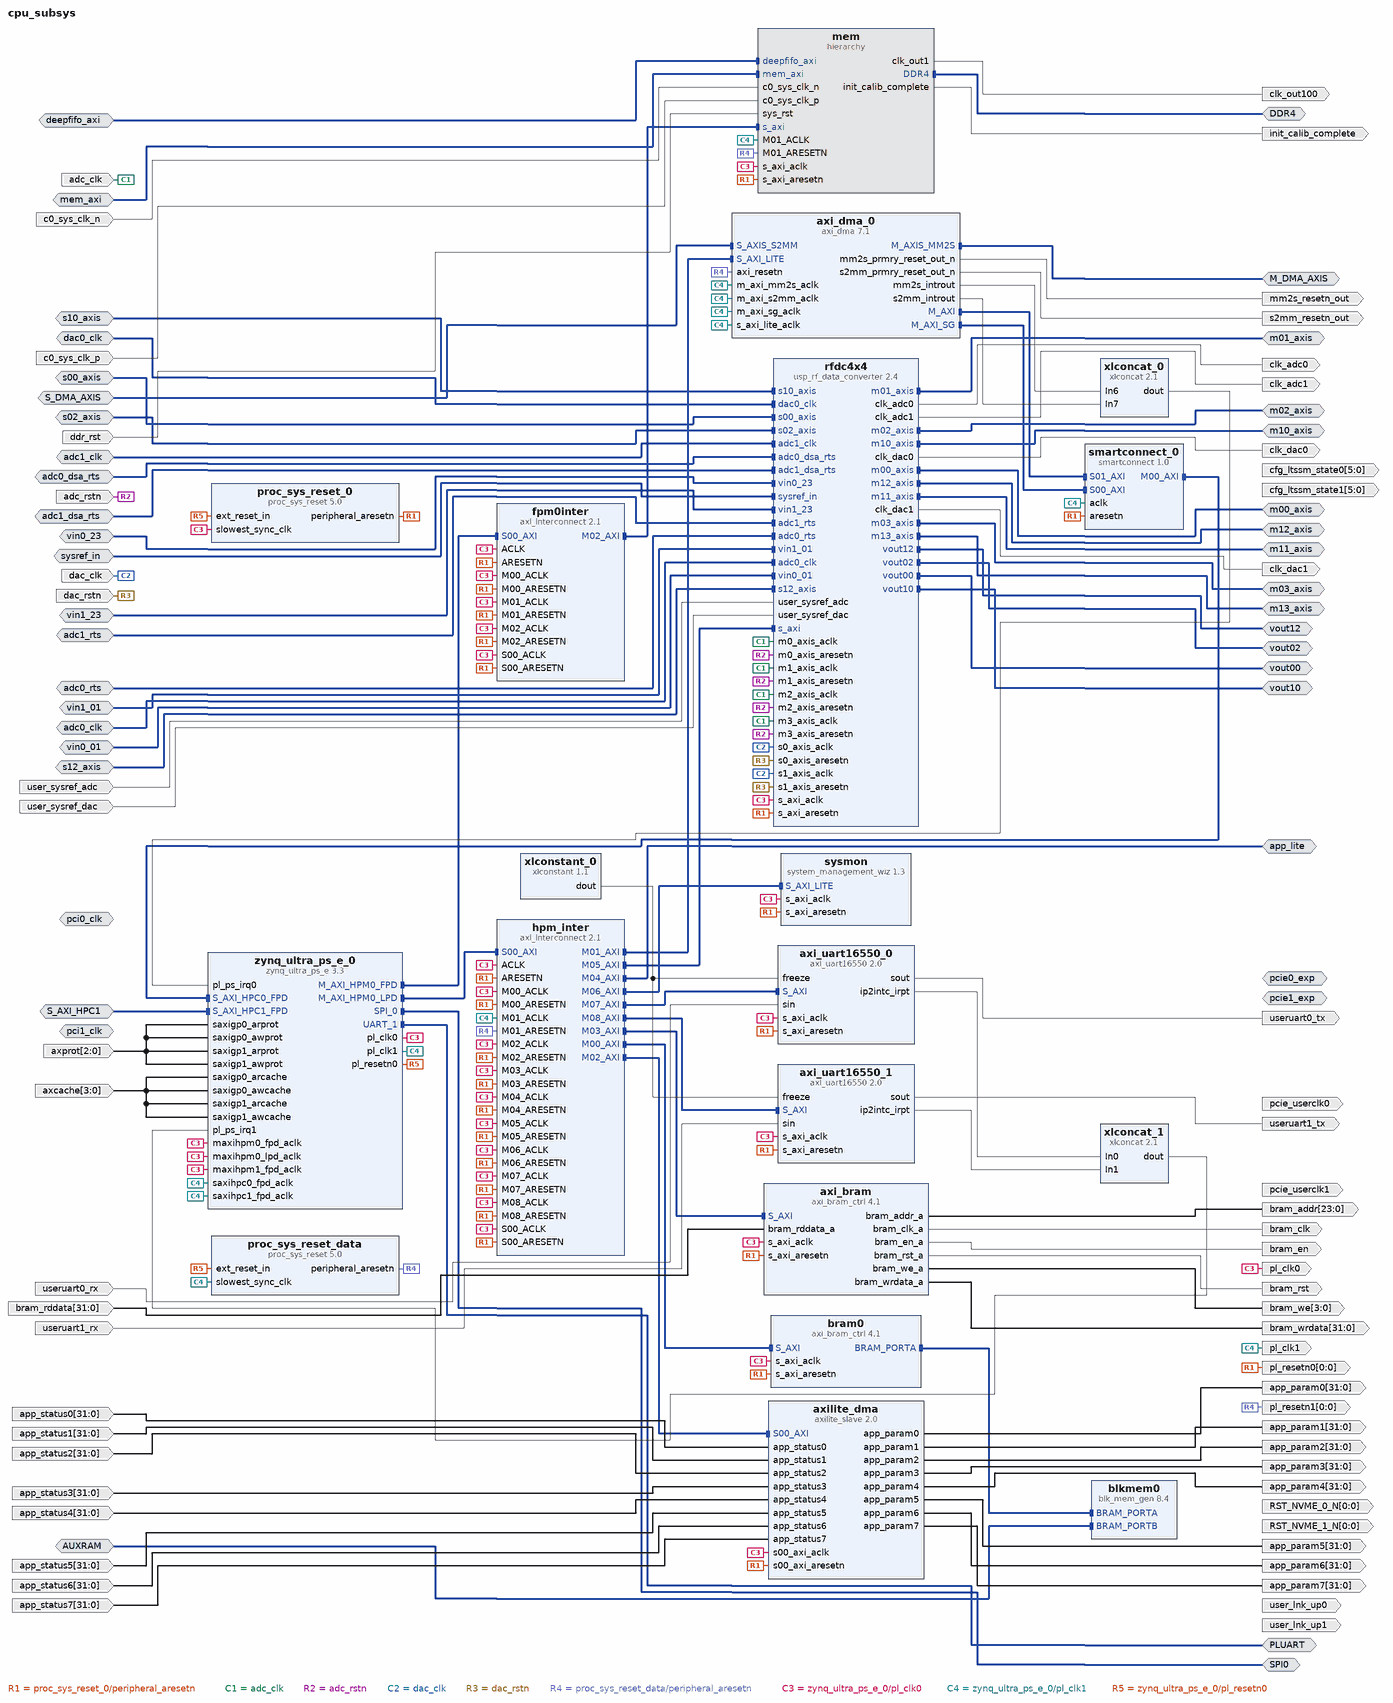
[diagram p0: block diagram of the top level]
# Vivado block design cpu_subsys, xczu47dr-ffve1156-2LVI-i, Vivado 2020.2
create_bd_design cpu_subsys

create_bd_intf_port -mode Slave -vlnv xilinx.com:interface:bram_rtl:1.0 AUXRAM
set_property -dict [list \
  CONFIG.MASTER_TYPE BRAM_CTRL \
  CONFIG.MEM_SIZE 65536 \
  CONFIG.MEM_WIDTH 128 \
  CONFIG.READ_WRITE_MODE READ_WRITE \
] [get_bd_intf_ports AUXRAM]
create_bd_intf_port -mode Master -vlnv xilinx.com:interface:ddr4_rtl:1.0 DDR4
create_bd_intf_port -mode Master -vlnv xilinx.com:interface:axis_rtl:1.0 M_DMA_AXIS
create_bd_intf_port -mode Master -vlnv xilinx.com:interface:uart_rtl:1.0 PLUART
create_bd_intf_port -mode Master -vlnv xilinx.com:interface:spi_rtl:1.0 SPI0
create_bd_intf_port -mode Slave -vlnv xilinx.com:interface:aximm_rtl:1.0 S_AXI_HPC1
set_property -dict [list \
  CONFIG.ADDR_WIDTH 49 \
  CONFIG.ARUSER_WIDTH 1 \
  CONFIG.AWUSER_WIDTH 1 \
  CONFIG.BUSER_WIDTH 0 \
  CONFIG.DATA_WIDTH 128 \
  CONFIG.HAS_BRESP 1 \
  CONFIG.HAS_BURST 1 \
  CONFIG.HAS_CACHE 1 \
  CONFIG.HAS_LOCK 1 \
  CONFIG.HAS_PROT 1 \
  CONFIG.HAS_QOS 1 \
  CONFIG.HAS_REGION 0 \
  CONFIG.HAS_RRESP 1 \
  CONFIG.HAS_WSTRB 1 \
  CONFIG.ID_WIDTH 6 \
  CONFIG.MAX_BURST_LENGTH 256 \
  CONFIG.NUM_READ_OUTSTANDING 16 \
  CONFIG.NUM_READ_THREADS 1 \
  CONFIG.NUM_WRITE_OUTSTANDING 16 \
  CONFIG.NUM_WRITE_THREADS 1 \
  CONFIG.PROTOCOL AXI4 \
  CONFIG.READ_WRITE_MODE READ_WRITE \
  CONFIG.RUSER_BITS_PER_BYTE 0 \
  CONFIG.RUSER_WIDTH 0 \
  CONFIG.SUPPORTS_NARROW_BURST 1 \
  CONFIG.WUSER_BITS_PER_BYTE 0 \
  CONFIG.WUSER_WIDTH 0 \
] [get_bd_intf_ports S_AXI_HPC1]
create_bd_intf_port -mode Slave -vlnv xilinx.com:interface:axis_rtl:1.0 S_DMA_AXIS
set_property -dict [list \
  CONFIG.HAS_TKEEP 1 \
  CONFIG.HAS_TLAST 1 \
  CONFIG.HAS_TREADY 1 \
  CONFIG.HAS_TSTRB 0 \
  CONFIG.LAYERED_METADATA undef \
  CONFIG.TDATA_NUM_BYTES 16 \
  CONFIG.TDEST_WIDTH 0 \
  CONFIG.TID_WIDTH 0 \
  CONFIG.TUSER_WIDTH 0 \
] [get_bd_intf_ports S_DMA_AXIS]
create_bd_intf_port -mode Slave -vlnv xilinx.com:interface:diff_clock_rtl:1.0 adc0_clk
set_property -dict {CONFIG.FREQ_HZ 300000000.0} [get_bd_intf_ports adc0_clk]
create_bd_intf_port -mode Slave -vlnv xilinx.com:interface:rfdc_dsa_rts_pins_rtl:1.0 adc0_dsa_rts
create_bd_intf_port -mode Slave -vlnv xilinx.com:interface:rfdc_rts_pins_rtl:1.0 adc0_rts
create_bd_intf_port -mode Slave -vlnv xilinx.com:interface:diff_clock_rtl:1.0 adc1_clk
create_bd_intf_port -mode Slave -vlnv xilinx.com:interface:rfdc_dsa_rts_pins_rtl:1.0 adc1_dsa_rts
create_bd_intf_port -mode Slave -vlnv xilinx.com:interface:rfdc_rts_pins_rtl:1.0 adc1_rts
create_bd_intf_port -mode Master -vlnv xilinx.com:interface:aximm_rtl:1.0 app_lite
set_property -dict [list \
  CONFIG.ADDR_WIDTH 40 \
  CONFIG.DATA_WIDTH 32 \
  CONFIG.NUM_READ_OUTSTANDING 2 \
  CONFIG.NUM_WRITE_OUTSTANDING 2 \
  CONFIG.PROTOCOL AXI4LITE \
] [get_bd_intf_ports app_lite]
create_bd_intf_port -mode Slave -vlnv xilinx.com:interface:diff_clock_rtl:1.0 dac0_clk
create_bd_intf_port -mode Slave -vlnv xilinx.com:interface:aximm_rtl:1.0 deepfifo_axi
set_property -dict [list \
  CONFIG.ADDR_WIDTH 36 \
  CONFIG.ARUSER_WIDTH 0 \
  CONFIG.AWUSER_WIDTH 0 \
  CONFIG.BUSER_WIDTH 0 \
  CONFIG.DATA_WIDTH 512 \
  CONFIG.HAS_BRESP 1 \
  CONFIG.HAS_BURST 1 \
  CONFIG.HAS_CACHE 1 \
  CONFIG.HAS_LOCK 1 \
  CONFIG.HAS_PROT 1 \
  CONFIG.HAS_QOS 1 \
  CONFIG.HAS_REGION 1 \
  CONFIG.HAS_RRESP 1 \
  CONFIG.HAS_WSTRB 1 \
  CONFIG.ID_WIDTH 0 \
  CONFIG.MAX_BURST_LENGTH 256 \
  CONFIG.NUM_READ_OUTSTANDING 2 \
  CONFIG.NUM_READ_THREADS 1 \
  CONFIG.NUM_WRITE_OUTSTANDING 2 \
  CONFIG.NUM_WRITE_THREADS 1 \
  CONFIG.PROTOCOL AXI4 \
  CONFIG.READ_WRITE_MODE READ_WRITE \
  CONFIG.RUSER_BITS_PER_BYTE 0 \
  CONFIG.RUSER_WIDTH 0 \
  CONFIG.SUPPORTS_NARROW_BURST 1 \
  CONFIG.WUSER_BITS_PER_BYTE 0 \
  CONFIG.WUSER_WIDTH 0 \
] [get_bd_intf_ports deepfifo_axi]
create_bd_intf_port -mode Master -vlnv xilinx.com:interface:axis_rtl:1.0 m00_axis
set_property -dict {CONFIG.FREQ_HZ 150000000} [get_bd_intf_ports m00_axis]
create_bd_intf_port -mode Master -vlnv xilinx.com:interface:axis_rtl:1.0 m01_axis
set_property -dict {CONFIG.FREQ_HZ 150000000} [get_bd_intf_ports m01_axis]
create_bd_intf_port -mode Master -vlnv xilinx.com:interface:axis_rtl:1.0 m02_axis
set_property -dict {CONFIG.FREQ_HZ 150000000} [get_bd_intf_ports m02_axis]
create_bd_intf_port -mode Master -vlnv xilinx.com:interface:axis_rtl:1.0 m03_axis
set_property -dict {CONFIG.FREQ_HZ 150000000} [get_bd_intf_ports m03_axis]
create_bd_intf_port -mode Master -vlnv xilinx.com:interface:axis_rtl:1.0 m10_axis
set_property -dict {CONFIG.FREQ_HZ 150000000} [get_bd_intf_ports m10_axis]
create_bd_intf_port -mode Master -vlnv xilinx.com:interface:axis_rtl:1.0 m11_axis
set_property -dict {CONFIG.FREQ_HZ 150000000} [get_bd_intf_ports m11_axis]
create_bd_intf_port -mode Master -vlnv xilinx.com:interface:axis_rtl:1.0 m12_axis
set_property -dict {CONFIG.FREQ_HZ 150000000} [get_bd_intf_ports m12_axis]
create_bd_intf_port -mode Master -vlnv xilinx.com:interface:axis_rtl:1.0 m13_axis
set_property -dict {CONFIG.FREQ_HZ 150000000} [get_bd_intf_ports m13_axis]
create_bd_intf_port -mode Slave -vlnv xilinx.com:interface:aximm_rtl:1.0 mem_axi
set_property -dict [list \
  CONFIG.ADDR_WIDTH 36 \
  CONFIG.ARUSER_WIDTH 0 \
  CONFIG.AWUSER_WIDTH 0 \
  CONFIG.BUSER_WIDTH 0 \
  CONFIG.DATA_WIDTH 512 \
  CONFIG.HAS_BRESP 1 \
  CONFIG.HAS_BURST 1 \
  CONFIG.HAS_CACHE 1 \
  CONFIG.HAS_LOCK 1 \
  CONFIG.HAS_PROT 1 \
  CONFIG.HAS_QOS 1 \
  CONFIG.HAS_REGION 0 \
  CONFIG.HAS_RRESP 1 \
  CONFIG.HAS_WSTRB 1 \
  CONFIG.ID_WIDTH 0 \
  CONFIG.MAX_BURST_LENGTH 256 \
  CONFIG.NUM_READ_OUTSTANDING 2 \
  CONFIG.NUM_READ_THREADS 1 \
  CONFIG.NUM_WRITE_OUTSTANDING 2 \
  CONFIG.NUM_WRITE_THREADS 1 \
  CONFIG.PROTOCOL AXI4 \
  CONFIG.READ_WRITE_MODE READ_WRITE \
  CONFIG.RUSER_BITS_PER_BYTE 0 \
  CONFIG.RUSER_WIDTH 0 \
  CONFIG.SUPPORTS_NARROW_BURST 1 \
  CONFIG.WUSER_BITS_PER_BYTE 0 \
  CONFIG.WUSER_WIDTH 0 \
] [get_bd_intf_ports mem_axi]
create_bd_intf_port -mode Slave -vlnv xilinx.com:interface:diff_clock_rtl:1.0 pci0_clk
create_bd_intf_port -mode Slave -vlnv xilinx.com:interface:diff_clock_rtl:1.0 pci1_clk
create_bd_intf_port -mode Master -vlnv xilinx.com:interface:pcie_7x_mgt_rtl:1.0 pcie0_exp
create_bd_intf_port -mode Master -vlnv xilinx.com:interface:pcie_7x_mgt_rtl:1.0 pcie1_exp
create_bd_intf_port -mode Slave -vlnv xilinx.com:interface:axis_rtl:1.0 s00_axis
set_property -dict [list \
  CONFIG.FREQ_HZ 150000000 \
  CONFIG.HAS_TKEEP 0 \
  CONFIG.HAS_TLAST 0 \
  CONFIG.HAS_TREADY 1 \
  CONFIG.HAS_TSTRB 0 \
  CONFIG.LAYERED_METADATA undef \
  CONFIG.TDATA_NUM_BYTES 32 \
  CONFIG.TDEST_WIDTH 0 \
  CONFIG.TID_WIDTH 0 \
  CONFIG.TUSER_WIDTH 0 \
] [get_bd_intf_ports s00_axis]
create_bd_intf_port -mode Slave -vlnv xilinx.com:interface:axis_rtl:1.0 s02_axis
set_property -dict [list \
  CONFIG.FREQ_HZ 150000000 \
  CONFIG.HAS_TKEEP 0 \
  CONFIG.HAS_TLAST 0 \
  CONFIG.HAS_TREADY 1 \
  CONFIG.HAS_TSTRB 0 \
  CONFIG.LAYERED_METADATA undef \
  CONFIG.TDATA_NUM_BYTES 32 \
  CONFIG.TDEST_WIDTH 0 \
  CONFIG.TID_WIDTH 0 \
  CONFIG.TUSER_WIDTH 0 \
] [get_bd_intf_ports s02_axis]
create_bd_intf_port -mode Slave -vlnv xilinx.com:interface:axis_rtl:1.0 s10_axis
set_property -dict [list \
  CONFIG.FREQ_HZ 150000000 \
  CONFIG.HAS_TKEEP 0 \
  CONFIG.HAS_TLAST 0 \
  CONFIG.HAS_TREADY 1 \
  CONFIG.HAS_TSTRB 0 \
  CONFIG.LAYERED_METADATA undef \
  CONFIG.TDATA_NUM_BYTES 32 \
  CONFIG.TDEST_WIDTH 0 \
  CONFIG.TID_WIDTH 0 \
  CONFIG.TUSER_WIDTH 0 \
] [get_bd_intf_ports s10_axis]
create_bd_intf_port -mode Slave -vlnv xilinx.com:interface:axis_rtl:1.0 s12_axis
set_property -dict [list \
  CONFIG.FREQ_HZ 150000000 \
  CONFIG.HAS_TKEEP 0 \
  CONFIG.HAS_TLAST 0 \
  CONFIG.HAS_TREADY 1 \
  CONFIG.HAS_TSTRB 0 \
  CONFIG.LAYERED_METADATA undef \
  CONFIG.TDATA_NUM_BYTES 32 \
  CONFIG.TDEST_WIDTH 0 \
  CONFIG.TID_WIDTH 0 \
  CONFIG.TUSER_WIDTH 0 \
] [get_bd_intf_ports s12_axis]
create_bd_intf_port -mode Slave -vlnv xilinx.com:display_usp_rf_data_converter:diff_pins_rtl:1.0 sysref_in
create_bd_intf_port -mode Slave -vlnv xilinx.com:interface:diff_analog_io_rtl:1.0 vin0_01
create_bd_intf_port -mode Slave -vlnv xilinx.com:interface:diff_analog_io_rtl:1.0 vin0_23
create_bd_intf_port -mode Slave -vlnv xilinx.com:interface:diff_analog_io_rtl:1.0 vin1_01
create_bd_intf_port -mode Slave -vlnv xilinx.com:interface:diff_analog_io_rtl:1.0 vin1_23
create_bd_intf_port -mode Master -vlnv xilinx.com:interface:diff_analog_io_rtl:1.0 vout00
create_bd_intf_port -mode Master -vlnv xilinx.com:interface:diff_analog_io_rtl:1.0 vout02
create_bd_intf_port -mode Master -vlnv xilinx.com:interface:diff_analog_io_rtl:1.0 vout10
create_bd_intf_port -mode Master -vlnv xilinx.com:interface:diff_analog_io_rtl:1.0 vout12
create_bd_port -dir O -from 0 -to 0 -type rst RST_NVME_0_N
create_bd_port -dir O -from 0 -to 0 -type rst RST_NVME_1_N
create_bd_port -dir I -type clk adc_clk
set_property -dict [list \
  CONFIG.ASSOCIATED_BUSIF m00_axis:m01_axis:m02_axis:m03_axis:m10_axis:m11_axis:m12_axis:m13_axis \
  CONFIG.ASSOCIATED_RESET adc_rstn \
  CONFIG.FREQ_HZ 150000000 \
] [get_bd_ports adc_clk]
create_bd_port -dir I -type rst adc_rstn
create_bd_port -dir O -from 31 -to 0 app_param0
create_bd_port -dir O -from 31 -to 0 app_param1
create_bd_port -dir O -from 31 -to 0 app_param2
create_bd_port -dir O -from 31 -to 0 app_param3
create_bd_port -dir O -from 31 -to 0 app_param4
create_bd_port -dir O -from 31 -to 0 app_param5
create_bd_port -dir O -from 31 -to 0 app_param6
create_bd_port -dir O -from 31 -to 0 app_param7
create_bd_port -dir I -from 31 -to 0 app_status0
create_bd_port -dir I -from 31 -to 0 app_status1
create_bd_port -dir I -from 31 -to 0 app_status2
create_bd_port -dir I -from 31 -to 0 app_status3
create_bd_port -dir I -from 31 -to 0 app_status4
create_bd_port -dir I -from 31 -to 0 app_status5
create_bd_port -dir I -from 31 -to 0 app_status6
create_bd_port -dir I -from 31 -to 0 app_status7
create_bd_port -dir I -from 3 -to 0 axcache
create_bd_port -dir I -from 2 -to 0 axprot
create_bd_port -dir O -from 23 -to 0 bram_addr
create_bd_port -dir O -type clk bram_clk
set_property -dict {CONFIG.ASSOCIATED_RESET bram_rst} [get_bd_ports bram_clk]
create_bd_port -dir O bram_en
create_bd_port -dir I -from 31 -to 0 bram_rddata
create_bd_port -dir O -type rst bram_rst
create_bd_port -dir O -from 3 -to 0 bram_we
create_bd_port -dir O -from 31 -to 0 bram_wrdata
create_bd_port -dir I -type clk c0_sys_clk_n
set_property -dict {CONFIG.FREQ_HZ 300000000} [get_bd_ports c0_sys_clk_n]
create_bd_port -dir I -type clk c0_sys_clk_p
set_property -dict {CONFIG.ASSOCIATED_RESET ddr_rst CONFIG.FREQ_HZ 300000000} [get_bd_ports c0_sys_clk_p]
create_bd_port -dir O -from 5 -to 0 cfg_ltssm_state0
create_bd_port -dir O -from 5 -to 0 cfg_ltssm_state1
create_bd_port -dir O -type clk clk_adc0
set_property -dict {CONFIG.FREQ_HZ 156250000} [get_bd_ports clk_adc0]
create_bd_port -dir O -type clk clk_adc1
set_property -dict {CONFIG.FREQ_HZ 156250000} [get_bd_ports clk_adc1]
create_bd_port -dir O -type clk clk_dac0
set_property -dict {CONFIG.FREQ_HZ 156250000} [get_bd_ports clk_dac0]
create_bd_port -dir O -type clk clk_dac1
set_property -dict {CONFIG.FREQ_HZ 156250000} [get_bd_ports clk_dac1]
create_bd_port -dir O -type clk clk_out100
create_bd_port -dir I -type clk dac_clk
set_property -dict [list \
  CONFIG.ASSOCIATED_BUSIF s00_axis:s02_axis:s10_axis:s12_axis \
  CONFIG.ASSOCIATED_RESET dac_rstn \
  CONFIG.FREQ_HZ 150000000 \
] [get_bd_ports dac_clk]
create_bd_port -dir I -type rst dac_rstn
create_bd_port -dir I -type rst ddr_rst
set_property -dict {CONFIG.POLARITY ACTIVE_HIGH} [get_bd_ports ddr_rst]
create_bd_port -dir O init_calib_complete
create_bd_port -dir O -type rst mm2s_resetn_out
create_bd_port -dir O -type clk pcie_userclk0
create_bd_port -dir O -type clk pcie_userclk1
create_bd_port -dir O -type clk pl_clk0
set_property -dict {CONFIG.ASSOCIATED_BUSIF app_lite} [get_bd_ports pl_clk0]
create_bd_port -dir O -type clk pl_clk1
set_property -dict [list \
  CONFIG.ASSOCIATED_BUSIF M_DMA_AXIS:S_DMA_AXIS:mem_axi:S_AXI_HPC1:deepfifo_axi \
  CONFIG.ASSOCIATED_RESET mm2s_resetn_out:s2mm_resetn_out:pl_resetn10:pl_resetn1 \
] [get_bd_ports pl_clk1]
create_bd_port -dir O -from 0 -to 0 -type rst pl_resetn0
create_bd_port -dir O -from 0 -to 0 -type rst pl_resetn1
create_bd_port -dir O -type rst s2mm_resetn_out
create_bd_port -dir O user_lnk_up0
create_bd_port -dir O user_lnk_up1
create_bd_port -dir I user_sysref_adc
create_bd_port -dir I user_sysref_dac
create_bd_port -dir I useruart0_rx
create_bd_port -dir O useruart0_tx
create_bd_port -dir I useruart1_rx
create_bd_port -dir O useruart1_tx

create_bd_cell -type ip -vlnv xilinx.com:ip:axi_bram_ctrl:4.1 axi_bram
set_property -dict {CONFIG.PROTOCOL AXI4LITE CONFIG.READ_LATENCY 4 CONFIG.SINGLE_PORT_BRAM 1} [get_bd_cells axi_bram]
create_bd_cell -type ip -vlnv xilinx.com:ip:axi_dma:7.1 axi_dma_0
set_property -dict [list \
  CONFIG.c_addr_width 64 \
  CONFIG.c_include_mm2s 1 \
  CONFIG.c_include_s2mm 1 \
  CONFIG.c_m_axi_mm2s_data_width 128 \
  CONFIG.c_m_axi_s2mm_data_width 128 \
  CONFIG.c_m_axis_mm2s_tdata_width 128 \
  CONFIG.c_mm2s_burst_size 256 \
  CONFIG.c_s2mm_burst_size 256 \
  CONFIG.c_s_axis_s2mm_tdata_width 128 \
  CONFIG.c_sg_include_stscntrl_strm 0 \
  CONFIG.c_sg_length_width 26 \
  CONFIG.c_single_interface 1 \
] [get_bd_cells axi_dma_0]
create_bd_cell -type ip -vlnv xilinx.com:ip:axi_uart16550:2.0 axi_uart16550_0
create_bd_cell -type ip -vlnv xilinx.com:ip:axi_uart16550:2.0 axi_uart16550_1
create_bd_cell -type ip -vlnv xilinx.com:user:axilite_slave:2.0 axilite_dma
create_bd_cell -type ip -vlnv xilinx.com:ip:blk_mem_gen:8.4 blkmem0
set_property -dict [list \
  CONFIG.Memory_Type True_Dual_Port_RAM \
  CONFIG.PRIM_type_to_Implement URAM \
  CONFIG.Port_B_Clock 100 \
  CONFIG.Port_B_Enable_Rate 100 \
  CONFIG.Port_B_Write_Rate 50 \
  CONFIG.Use_RSTB_Pin true \
] [get_bd_cells blkmem0]
create_bd_cell -type ip -vlnv xilinx.com:ip:axi_bram_ctrl:4.1 bram0
set_property -dict {CONFIG.DATA_WIDTH 128 CONFIG.SINGLE_PORT_BRAM 1} [get_bd_cells bram0]
create_bd_cell -type ip -vlnv xilinx.com:ip:axi_interconnect:2.1 fpm0inter
set_property -dict {CONFIG.NUM_MI 3} [get_bd_cells fpm0inter]
create_bd_cell -type ip -vlnv xilinx.com:ip:axi_interconnect:2.1 hpm_inter
set_property -dict {CONFIG.NUM_MI 9 CONFIG.NUM_SI 1} [get_bd_cells hpm_inter]
create_bd_cell -type hier mem
create_bd_cell -type ip -vlnv xilinx.com:ip:proc_sys_reset:5.0 proc_sys_reset_0
create_bd_cell -type ip -vlnv xilinx.com:ip:proc_sys_reset:5.0 proc_sys_reset_data
create_bd_cell -type ip -vlnv xilinx.com:ip:usp_rf_data_converter:2.4 rfdc4x4
set_property -dict [list \
  CONFIG.ADC0_Clock_Dist 0 \
  CONFIG.ADC0_Clock_Source 0 \
  CONFIG.ADC0_Multi_Tile_Sync true \
  CONFIG.ADC0_Outclk_Freq 156.250 \
  CONFIG.ADC0_PLL_Enable true \
  CONFIG.ADC0_Refclk_Freq 400.000 \
  CONFIG.ADC0_Sampling_Rate 5 \
  CONFIG.ADC1_Clock_Dist 1 \
  CONFIG.ADC1_Clock_Source 1 \
  CONFIG.ADC1_Multi_Tile_Sync true \
  CONFIG.ADC1_Outclk_Freq 156.250 \
  CONFIG.ADC1_PLL_Enable true \
  CONFIG.ADC1_Refclk_Freq 400.000 \
  CONFIG.ADC1_Sampling_Rate 5 \
  CONFIG.ADC2_Clock_Source 1 \
  CONFIG.ADC2_Multi_Tile_Sync true \
  CONFIG.ADC2_Outclk_Freq 156.250 \
  CONFIG.ADC2_PLL_Enable true \
  CONFIG.ADC2_Refclk_Freq 400.000 \
  CONFIG.ADC2_Sampling_Rate 5 \
  CONFIG.ADC3_Clock_Source 1 \
  CONFIG.ADC3_Multi_Tile_Sync true \
  CONFIG.ADC3_Outclk_Freq 156.250 \
  CONFIG.ADC3_PLL_Enable true \
  CONFIG.ADC3_Refclk_Freq 400.000 \
  CONFIG.ADC3_Sampling_Rate 5 \
  CONFIG.ADC_CalOpt_Mode00 2 \
  CONFIG.ADC_CalOpt_Mode02 2 \
  CONFIG.ADC_CalOpt_Mode10 2 \
  CONFIG.ADC_CalOpt_Mode12 2 \
  CONFIG.ADC_CalOpt_Mode20 2 \
  CONFIG.ADC_CalOpt_Mode22 2 \
  CONFIG.ADC_CalOpt_Mode30 2 \
  CONFIG.ADC_CalOpt_Mode32 2 \
  CONFIG.ADC_Coarse_Mixer_Freq00 1 \
  CONFIG.ADC_Coarse_Mixer_Freq02 1 \
  CONFIG.ADC_Coarse_Mixer_Freq10 1 \
  CONFIG.ADC_Coarse_Mixer_Freq12 1 \
  CONFIG.ADC_Coarse_Mixer_Freq20 1 \
  CONFIG.ADC_Coarse_Mixer_Freq22 1 \
  CONFIG.ADC_Coarse_Mixer_Freq30 1 \
  CONFIG.ADC_Coarse_Mixer_Freq32 1 \
  CONFIG.ADC_DSA_RTS true \
  CONFIG.ADC_Data_Type00 1 \
  CONFIG.ADC_Data_Type02 1 \
  CONFIG.ADC_Data_Type10 1 \
  CONFIG.ADC_Data_Type12 1 \
  CONFIG.ADC_Data_Type20 1 \
  CONFIG.ADC_Data_Type22 1 \
  CONFIG.ADC_Data_Type30 1 \
  CONFIG.ADC_Data_Type32 1 \
  CONFIG.ADC_Data_Width00 8 \
  CONFIG.ADC_Data_Width02 8 \
  CONFIG.ADC_Data_Width10 8 \
  CONFIG.ADC_Data_Width12 8 \
  CONFIG.ADC_Data_Width20 8 \
  CONFIG.ADC_Data_Width22 8 \
  CONFIG.ADC_Data_Width30 8 \
  CONFIG.ADC_Data_Width32 8 \
  CONFIG.ADC_Decimation_Mode00 4 \
  CONFIG.ADC_Decimation_Mode02 4 \
  CONFIG.ADC_Decimation_Mode10 4 \
  CONFIG.ADC_Decimation_Mode12 4 \
  CONFIG.ADC_Decimation_Mode20 4 \
  CONFIG.ADC_Decimation_Mode22 4 \
  CONFIG.ADC_Decimation_Mode30 4 \
  CONFIG.ADC_Decimation_Mode32 4 \
  CONFIG.ADC_Mixer_Mode00 0 \
  CONFIG.ADC_Mixer_Mode02 0 \
  CONFIG.ADC_Mixer_Mode10 0 \
  CONFIG.ADC_Mixer_Mode12 0 \
  CONFIG.ADC_Mixer_Mode20 0 \
  CONFIG.ADC_Mixer_Mode22 0 \
  CONFIG.ADC_Mixer_Mode30 0 \
  CONFIG.ADC_Mixer_Mode32 0 \
  CONFIG.ADC_Mixer_Type02 1 \
  CONFIG.ADC_Mixer_Type03 1 \
  CONFIG.ADC_Mixer_Type10 1 \
  CONFIG.ADC_Mixer_Type11 1 \
  CONFIG.ADC_Mixer_Type12 1 \
  CONFIG.ADC_Mixer_Type13 1 \
  CONFIG.ADC_Mixer_Type20 1 \
  CONFIG.ADC_Mixer_Type21 1 \
  CONFIG.ADC_Mixer_Type22 1 \
  CONFIG.ADC_Mixer_Type23 1 \
  CONFIG.ADC_Mixer_Type30 1 \
  CONFIG.ADC_Mixer_Type31 1 \
  CONFIG.ADC_Mixer_Type32 1 \
  CONFIG.ADC_Mixer_Type33 1 \
  CONFIG.ADC_Nyquist00 1 \
  CONFIG.ADC_Nyquist02 1 \
  CONFIG.ADC_Nyquist10 1 \
  CONFIG.ADC_Nyquist12 1 \
  CONFIG.ADC_Nyquist20 1 \
  CONFIG.ADC_Nyquist22 1 \
  CONFIG.ADC_Nyquist30 1 \
  CONFIG.ADC_Nyquist32 1 \
  CONFIG.ADC_OBS02 false \
  CONFIG.ADC_OBS12 false \
  CONFIG.ADC_OBS22 false \
  CONFIG.ADC_OBS32 false \
  CONFIG.ADC_RTS true \
  CONFIG.ADC_Slice02_Enable true \
  CONFIG.ADC_Slice10_Enable true \
  CONFIG.ADC_Slice12_Enable true \
  CONFIG.ADC_Slice20_Enable true \
  CONFIG.ADC_Slice22_Enable true \
  CONFIG.ADC_Slice30_Enable true \
  CONFIG.ADC_Slice32_Enable true \
  CONFIG.Axiclk_Freq 100 \
  CONFIG.DAC0_Clock_Dist 1 \
  CONFIG.DAC0_Multi_Tile_Sync true \
  CONFIG.DAC0_Outclk_Freq 156.250 \
  CONFIG.DAC0_PLL_Enable true \
  CONFIG.DAC0_Refclk_Freq 400.000 \
  CONFIG.DAC0_Sampling_Rate 5 \
  CONFIG.DAC1_Clock_Source 4 \
  CONFIG.DAC1_Multi_Tile_Sync true \
  CONFIG.DAC1_Outclk_Freq 156.250 \
  CONFIG.DAC1_PLL_Enable true \
  CONFIG.DAC1_Refclk_Freq 400.000 \
  CONFIG.DAC1_Sampling_Rate 5 \
  CONFIG.DAC_Coarse_Mixer_Freq00 2 \
  CONFIG.DAC_Coarse_Mixer_Freq02 2 \
  CONFIG.DAC_Coarse_Mixer_Freq10 2 \
  CONFIG.DAC_Coarse_Mixer_Freq12 2 \
  CONFIG.DAC_Interpolation_Mode00 4 \
  CONFIG.DAC_Interpolation_Mode02 4 \
  CONFIG.DAC_Interpolation_Mode10 4 \
  CONFIG.DAC_Interpolation_Mode12 4 \
  CONFIG.DAC_Mixer_Mode00 0 \
  CONFIG.DAC_Mixer_Mode02 0 \
  CONFIG.DAC_Mixer_Mode10 0 \
  CONFIG.DAC_Mixer_Mode12 0 \
  CONFIG.DAC_Mixer_Type00 1 \
  CONFIG.DAC_Mixer_Type02 1 \
  CONFIG.DAC_Mixer_Type10 1 \
  CONFIG.DAC_Mixer_Type12 1 \
  CONFIG.DAC_NCO_Freq00 1.8 \
  CONFIG.DAC_NCO_Freq02 1.8 \
  CONFIG.DAC_NCO_Freq10 1.8 \
  CONFIG.DAC_NCO_Freq12 1.8 \
  CONFIG.DAC_Nyquist00 1 \
  CONFIG.DAC_Nyquist02 1 \
  CONFIG.DAC_Nyquist10 1 \
  CONFIG.DAC_Nyquist12 1 \
  CONFIG.DAC_Slice00_Enable true \
  CONFIG.DAC_Slice02_Enable true \
  CONFIG.DAC_Slice10_Enable true \
  CONFIG.DAC_Slice12_Enable true \
  CONFIG.PL_Clock_Freq 156.25 \
  CONFIG.RF_Analyzer 1 \
] [get_bd_cells rfdc4x4]
create_bd_cell -type ip -vlnv xilinx.com:ip:smartconnect:1.0 smartconnect_0
set_property -dict {CONFIG.NUM_CLKS 1} [get_bd_cells smartconnect_0]
create_bd_cell -type ip -vlnv xilinx.com:ip:system_management_wiz:1.3 sysmon
create_bd_cell -type ip -vlnv xilinx.com:ip:xlconcat:2.1 xlconcat_0
set_property -dict {CONFIG.NUM_PORTS 8} [get_bd_cells xlconcat_0]
create_bd_cell -type ip -vlnv xilinx.com:ip:xlconcat:2.1 xlconcat_1
set_property -dict {CONFIG.NUM_PORTS 2} [get_bd_cells xlconcat_1]
create_bd_cell -type ip -vlnv xilinx.com:ip:xlconstant:1.1 xlconstant_0
set_property -dict {CONFIG.CONST_VAL 0} [get_bd_cells xlconstant_0]
create_bd_cell -type ip -vlnv xilinx.com:ip:zynq_ultra_ps_e:3.3 zynq_ultra_ps_e_0
set_property -dict [list \
  CONFIG.CAN0_BOARD_INTERFACE custom \
  CONFIG.CAN1_BOARD_INTERFACE custom \
  CONFIG.CSU_BOARD_INTERFACE custom \
  CONFIG.DP_BOARD_INTERFACE custom \
  CONFIG.GEM0_BOARD_INTERFACE custom \
  CONFIG.GEM1_BOARD_INTERFACE custom \
  CONFIG.GEM2_BOARD_INTERFACE custom \
  CONFIG.GEM3_BOARD_INTERFACE custom \
  CONFIG.GPIO_BOARD_INTERFACE custom \
  CONFIG.IIC0_BOARD_INTERFACE custom \
  CONFIG.IIC1_BOARD_INTERFACE custom \
  CONFIG.NAND_BOARD_INTERFACE custom \
  CONFIG.PCIE_BOARD_INTERFACE custom \
  CONFIG.PJTAG_BOARD_INTERFACE custom \
  CONFIG.PMU_BOARD_INTERFACE custom \
  CONFIG.PSU_BANK_0_IO_STANDARD LVCMOS18 \
  CONFIG.PSU_BANK_1_IO_STANDARD LVCMOS33 \
  CONFIG.PSU_BANK_2_IO_STANDARD LVCMOS18 \
  CONFIG.PSU_BANK_3_IO_STANDARD LVCMOS33 \
  CONFIG.PSU_USB3__DUAL_CLOCK_ENABLE 1 \
  CONFIG.PSU__CAN1__PERIPHERAL__ENABLE 0 \
  CONFIG.PSU__CRF_APB__ACPU_CTRL__FREQMHZ 1200 \
  CONFIG.PSU__CRF_APB__ACPU_CTRL__SRCSEL APLL \
  CONFIG.PSU__CRF_APB__APLL_CTRL__SRCSEL PSS_REF_CLK \
  CONFIG.PSU__CRF_APB__DBG_FPD_CTRL__FREQMHZ 250 \
  CONFIG.PSU__CRF_APB__DBG_FPD_CTRL__SRCSEL IOPLL \
  CONFIG.PSU__CRF_APB__DBG_TRACE_CTRL__FREQMHZ 250 \
  CONFIG.PSU__CRF_APB__DBG_TRACE_CTRL__SRCSEL IOPLL \
  CONFIG.PSU__CRF_APB__DBG_TSTMP_CTRL__FREQMHZ 250 \
  CONFIG.PSU__CRF_APB__DBG_TSTMP_CTRL__SRCSEL IOPLL \
  CONFIG.PSU__CRF_APB__DDR_CTRL__FREQMHZ 1200 \
  CONFIG.PSU__CRF_APB__DDR_CTRL__SRCSEL DPLL \
  CONFIG.PSU__CRF_APB__DPDMA_REF_CTRL__FREQMHZ 600 \
  CONFIG.PSU__CRF_APB__DPDMA_REF_CTRL__SRCSEL DPLL \
  CONFIG.PSU__CRF_APB__DPLL_CTRL__SRCSEL PSS_REF_CLK \
  CONFIG.PSU__CRF_APB__DP_AUDIO_REF_CTRL__SRCSEL RPLL \
  CONFIG.PSU__CRF_APB__DP_STC_REF_CTRL__SRCSEL RPLL \
  CONFIG.PSU__CRF_APB__DP_VIDEO_REF_CTRL__SRCSEL VPLL \
  CONFIG.PSU__CRF_APB__GDMA_REF_CTRL__FREQMHZ 600 \
  CONFIG.PSU__CRF_APB__GDMA_REF_CTRL__SRCSEL DPLL \
  CONFIG.PSU__CRF_APB__GPU_REF_CTRL__FREQMHZ 600 \
  CONFIG.PSU__CRF_APB__GPU_REF_CTRL__SRCSEL DPLL \
  CONFIG.PSU__CRF_APB__TOPSW_LSBUS_CTRL__FREQMHZ 100 \
  CONFIG.PSU__CRF_APB__TOPSW_LSBUS_CTRL__SRCSEL IOPLL \
  CONFIG.PSU__CRF_APB__TOPSW_MAIN_CTRL__FREQMHZ 533 \
  CONFIG.PSU__CRF_APB__TOPSW_MAIN_CTRL__SRCSEL APLL \
  CONFIG.PSU__CRF_APB__VPLL_CTRL__SRCSEL PSS_REF_CLK \
  CONFIG.PSU__CRL_APB__ADMA_REF_CTRL__FREQMHZ 500 \
  CONFIG.PSU__CRL_APB__ADMA_REF_CTRL__SRCSEL IOPLL \
  CONFIG.PSU__CRL_APB__CAN1_REF_CTRL__FREQMHZ 100 \
  CONFIG.PSU__CRL_APB__CAN1_REF_CTRL__SRCSEL IOPLL \
  CONFIG.PSU__CRL_APB__CPU_R5_CTRL__FREQMHZ 500 \
  CONFIG.PSU__CRL_APB__CPU_R5_CTRL__SRCSEL IOPLL \
  CONFIG.PSU__CRL_APB__DBG_LPD_CTRL__FREQMHZ 250 \
  CONFIG.PSU__CRL_APB__DBG_LPD_CTRL__SRCSEL IOPLL \
  CONFIG.PSU__CRL_APB__GEM3_REF_CTRL__FREQMHZ 125 \
  CONFIG.PSU__CRL_APB__GEM3_REF_CTRL__SRCSEL IOPLL \
  CONFIG.PSU__CRL_APB__I2C0_REF_CTRL__FREQMHZ 100 \
  CONFIG.PSU__CRL_APB__I2C0_REF_CTRL__SRCSEL IOPLL \
  CONFIG.PSU__CRL_APB__I2C1_REF_CTRL__FREQMHZ 100 \
  CONFIG.PSU__CRL_APB__I2C1_REF_CTRL__SRCSEL IOPLL \
  CONFIG.PSU__CRL_APB__IOPLL_CTRL__SRCSEL PSS_REF_CLK \
  CONFIG.PSU__CRL_APB__IOU_SWITCH_CTRL__FREQMHZ 250 \
  CONFIG.PSU__CRL_APB__IOU_SWITCH_CTRL__SRCSEL IOPLL \
  CONFIG.PSU__CRL_APB__LPD_LSBUS_CTRL__FREQMHZ 100 \
  CONFIG.PSU__CRL_APB__LPD_LSBUS_CTRL__SRCSEL IOPLL \
  CONFIG.PSU__CRL_APB__LPD_SWITCH_CTRL__FREQMHZ 500 \
  CONFIG.PSU__CRL_APB__LPD_SWITCH_CTRL__SRCSEL IOPLL \
  CONFIG.PSU__CRL_APB__PCAP_CTRL__FREQMHZ 200 \
  CONFIG.PSU__CRL_APB__PCAP_CTRL__SRCSEL IOPLL \
  CONFIG.PSU__CRL_APB__PL0_REF_CTRL__FREQMHZ 100 \
  CONFIG.PSU__CRL_APB__PL0_REF_CTRL__SRCSEL IOPLL \
  CONFIG.PSU__CRL_APB__PL1_REF_CTRL__FREQMHZ 200 \
  CONFIG.PSU__CRL_APB__QSPI_REF_CTRL__FREQMHZ 125 \
  CONFIG.PSU__CRL_APB__QSPI_REF_CTRL__SRCSEL IOPLL \
  CONFIG.PSU__CRL_APB__RPLL_CTRL__SRCSEL PSS_REF_CLK \
  CONFIG.PSU__CRL_APB__SDIO0_REF_CTRL__SRCSEL IOPLL \
  CONFIG.PSU__CRL_APB__SDIO1_REF_CTRL__FREQMHZ 200 \
  CONFIG.PSU__CRL_APB__SDIO1_REF_CTRL__SRCSEL IOPLL \
  CONFIG.PSU__CRL_APB__SPI0_REF_CTRL__SRCSEL IOPLL \
  CONFIG.PSU__CRL_APB__SPI1_REF_CTRL__SRCSEL IOPLL \
  CONFIG.PSU__CRL_APB__TIMESTAMP_REF_CTRL__FREQMHZ 100 \
  CONFIG.PSU__CRL_APB__TIMESTAMP_REF_CTRL__SRCSEL IOPLL \
  CONFIG.PSU__CRL_APB__UART0_REF_CTRL__FREQMHZ 100 \
  CONFIG.PSU__CRL_APB__UART0_REF_CTRL__SRCSEL IOPLL \
  CONFIG.PSU__CRL_APB__UART1_REF_CTRL__FREQMHZ 100 \
  CONFIG.PSU__CRL_APB__UART1_REF_CTRL__SRCSEL IOPLL \
  CONFIG.PSU__CRL_APB__USB0_BUS_REF_CTRL__FREQMHZ 250 \
  CONFIG.PSU__CRL_APB__USB0_BUS_REF_CTRL__SRCSEL IOPLL \
  CONFIG.PSU__CRL_APB__USB3_DUAL_REF_CTRL__FREQMHZ 20 \
  CONFIG.PSU__CRL_APB__USB3_DUAL_REF_CTRL__SRCSEL IOPLL \
  CONFIG.PSU__CRL_APB__USB3__ENABLE 1 \
  CONFIG.PSU__CSUPMU__PERIPHERAL__VALID 0 \
  CONFIG.PSU__DDRC__BUS_WIDTH {64 Bit} \
  CONFIG.PSU__DDRC__COMPONENTS Components \
  CONFIG.PSU__DDRC__DEVICE_CAPACITY {8192 MBits} \
  CONFIG.PSU__DDRC__DRAM_WIDTH {16 Bits} \
  CONFIG.PSU__DDRC__ECC Disabled \
  CONFIG.PSU__DDRC__MEMORY_TYPE {DDR 4} \
  CONFIG.PSU__DDRC__SPEED_BIN DDR4_2400P \
  CONFIG.PSU__DDR_HIGH_ADDRESS_GUI_ENABLE 1 \
  CONFIG.PSU__DDR__INTERFACE__FREQMHZ 600.000 \
  CONFIG.PSU__DEVICE_TYPE RFSOC \
  CONFIG.PSU__DISPLAYPORT__PERIPHERAL__ENABLE 0 \
  CONFIG.PSU__DLL__ISUSED 1 \
  CONFIG.PSU__ENET3__FIFO__ENABLE 0 \
  CONFIG.PSU__ENET3__GRP_MDIO__ENABLE 1 \
  CONFIG.PSU__ENET3__GRP_MDIO__IO {MIO 76 .. 77} \
  CONFIG.PSU__ENET3__PERIPHERAL__ENABLE 1 \
  CONFIG.PSU__ENET3__PERIPHERAL__IO {GT Lane3} \
  CONFIG.PSU__ENET3__PTP__ENABLE 0 \
  CONFIG.PSU__ENET3__TSU__ENABLE 0 \
  CONFIG.PSU__FPGA_PL0_ENABLE 1 \
  CONFIG.PSU__FPGA_PL1_ENABLE 1 \
  CONFIG.PSU__GEM3_COHERENCY 0 \
  CONFIG.PSU__GEM3_ROUTE_THROUGH_FPD 0 \
  CONFIG.PSU__GEM3__REF_CLK_FREQ 125 \
  CONFIG.PSU__GEM3__REF_CLK_SEL {Ref Clk3} \
  CONFIG.PSU__GEM__TSU__ENABLE 0 \
  CONFIG.PSU__GPIO0_MIO__IO {MIO 0 .. 25} \
  CONFIG.PSU__GPIO0_MIO__PERIPHERAL__ENABLE 1 \
  CONFIG.PSU__GPIO1_MIO__IO {MIO 26 .. 51} \
  CONFIG.PSU__GPIO1_MIO__PERIPHERAL__ENABLE 1 \
  CONFIG.PSU__GPIO2_MIO__IO {MIO 52 .. 77} \
  CONFIG.PSU__GPIO2_MIO__PERIPHERAL__ENABLE 1 \
  CONFIG.PSU__GPIO_EMIO__WIDTH {[93:0]} \
  CONFIG.PSU__GPU_PP0__POWER__ON 0 \
  CONFIG.PSU__GPU_PP1__POWER__ON 0 \
  CONFIG.PSU__I2C0__PERIPHERAL__ENABLE 1 \
  CONFIG.PSU__I2C0__PERIPHERAL__IO {MIO 30 .. 31} \
  CONFIG.PSU__I2C1__PERIPHERAL__ENABLE 1 \
  CONFIG.PSU__I2C1__PERIPHERAL__IO {MIO 40 .. 41} \
  CONFIG.PSU__IOU_SLCR__IOU_TTC_APB_CLK__TTC0_SEL APB \
  CONFIG.PSU__IOU_SLCR__IOU_TTC_APB_CLK__TTC1_SEL APB \
  CONFIG.PSU__IOU_SLCR__IOU_TTC_APB_CLK__TTC2_SEL APB \
  CONFIG.PSU__IOU_SLCR__IOU_TTC_APB_CLK__TTC3_SEL APB \
  CONFIG.PSU__LPD_SLCR__CSUPMU__FREQMHZ 100 \
  CONFIG.PSU__MAXIGP0__DATA_WIDTH 128 \
  CONFIG.PSU__MAXIGP2__DATA_WIDTH 128 \
  CONFIG.PSU__NUM_FABRIC_RESETS 2 \
  CONFIG.PSU__OVERRIDE_HPX_QOS 0 \
  CONFIG.PSU__OVERRIDE__BASIC_CLOCK 0 \
  CONFIG.PSU__PCIE__BAR0_VAL 0x0 \
  CONFIG.PSU__PCIE__BAR1_VAL 0x0 \
  CONFIG.PSU__PCIE__BAR2_VAL 0x0 \
  CONFIG.PSU__PCIE__BAR3_VAL 0x0 \
  CONFIG.PSU__PCIE__BAR4_VAL 0x0 \
  CONFIG.PSU__PCIE__BAR5_VAL 0x0 \
  CONFIG.PSU__PCIE__CLASS_CODE_BASE 0x06 \
  CONFIG.PSU__PCIE__CLASS_CODE_INTERFACE 0x0 \
  CONFIG.PSU__PCIE__CLASS_CODE_SUB 0x04 \
  CONFIG.PSU__PCIE__CLASS_CODE_VALUE 0x60400 \
  CONFIG.PSU__PCIE__DEVICE_ID 0xD011 \
  CONFIG.PSU__PCIE__DEVICE_PORT_TYPE {Root Port} \
  CONFIG.PSU__PCIE__EROM_VAL 0x0 \
  CONFIG.PSU__PCIE__LANE0__ENABLE 1 \
  CONFIG.PSU__PCIE__LANE0__IO {GT Lane0} \
  CONFIG.PSU__PCIE__LANE1__ENABLE 1 \
  CONFIG.PSU__PCIE__LANE1__IO {GT Lane1} \
  CONFIG.PSU__PCIE__LINK_SPEED {5.0 Gb/s} \
  CONFIG.PSU__PCIE__MAXIMUM_LINK_WIDTH x2 \
  CONFIG.PSU__PCIE__MAX_PAYLOAD_SIZE {256 bytes} \
  CONFIG.PSU__PCIE__PERIPHERAL__ENABLE 1 \
  CONFIG.PSU__PCIE__PERIPHERAL__ENDPOINT_ENABLE 0 \
  CONFIG.PSU__PCIE__PERIPHERAL__ROOTPORT_ENABLE 1 \
  CONFIG.PSU__PCIE__PERIPHERAL__ROOTPORT_IO {MIO 49} \
  CONFIG.PSU__PCIE__REF_CLK_FREQ 100 \
  CONFIG.PSU__PCIE__REF_CLK_SEL {Ref Clk0} \
  CONFIG.PSU__PCIE__REVISION_ID 0x0 \
  CONFIG.PSU__PCIE__SUBSYSTEM_ID 0x7 \
  CONFIG.PSU__PCIE__SUBSYSTEM_VENDOR_ID 0x10EE \
  CONFIG.PSU__PCIE__VENDOR_ID 0x10EE \
  CONFIG.PSU__PMU__PERIPHERAL__ENABLE 0 \
  CONFIG.PSU__PRESET_APPLIED 0 \
  CONFIG.PSU__PSS_REF_CLK__FREQMHZ 33.333 \
  CONFIG.PSU__QSPI_COHERENCY 0 \
  CONFIG.PSU__QSPI_ROUTE_THROUGH_FPD 0 \
  CONFIG.PSU__QSPI__GRP_FBCLK__ENABLE 0 \
  CONFIG.PSU__QSPI__PERIPHERAL__DATA_MODE x4 \
  CONFIG.PSU__QSPI__PERIPHERAL__ENABLE 1 \
  CONFIG.PSU__QSPI__PERIPHERAL__IO {MIO 0 .. 5} \
  CONFIG.PSU__QSPI__PERIPHERAL__MODE Single \
  CONFIG.PSU__SATA__PERIPHERAL__ENABLE 0 \
  CONFIG.PSU__SD0__DATA_TRANSFER_MODE 8Bit \
  CONFIG.PSU__SD0__GRP_POW__ENABLE 1 \
  CONFIG.PSU__SD0__GRP_POW__IO {MIO 23} \
  CONFIG.PSU__SD0__PERIPHERAL__ENABLE 1 \
  CONFIG.PSU__SD0__PERIPHERAL__IO {MIO 13 .. 22} \
  CONFIG.PSU__SD0__RESET__ENABLE 1 \
  CONFIG.PSU__SD0__SLOT_TYPE eMMC \
  CONFIG.PSU__SD1__PERIPHERAL__ENABLE 0 \
  CONFIG.PSU__SPI0__GRP_SS0__IO EMIO \
  CONFIG.PSU__SPI0__PERIPHERAL__ENABLE 1 \
  CONFIG.PSU__SPI0__PERIPHERAL__IO EMIO \
  CONFIG.PSU__SWDT0__CLOCK__ENABLE 0 \
  CONFIG.PSU__SWDT0__PERIPHERAL__ENABLE 1 \
  CONFIG.PSU__SWDT0__RESET__ENABLE 0 \
  CONFIG.PSU__SWDT1__CLOCK__ENABLE 0 \
  CONFIG.PSU__SWDT1__PERIPHERAL__ENABLE 1 \
  CONFIG.PSU__SWDT1__RESET__ENABLE 0 \
  CONFIG.PSU__TSU__BUFG_PORT_PAIR 0 \
  CONFIG.PSU__TTC0__CLOCK__ENABLE 0 \
  CONFIG.PSU__TTC0__PERIPHERAL__ENABLE 1 \
  CONFIG.PSU__TTC0__WAVEOUT__ENABLE 0 \
  CONFIG.PSU__TTC1__CLOCK__ENABLE 0 \
  CONFIG.PSU__TTC1__PERIPHERAL__ENABLE 1 \
  CONFIG.PSU__TTC1__WAVEOUT__ENABLE 0 \
  CONFIG.PSU__TTC2__CLOCK__ENABLE 0 \
  CONFIG.PSU__TTC2__PERIPHERAL__ENABLE 1 \
  CONFIG.PSU__TTC2__WAVEOUT__ENABLE 0 \
  CONFIG.PSU__TTC3__CLOCK__ENABLE 0 \
  CONFIG.PSU__TTC3__PERIPHERAL__ENABLE 1 \
  CONFIG.PSU__TTC3__WAVEOUT__ENABLE 0 \
  CONFIG.PSU__UART0__BAUD_RATE 115200 \
  CONFIG.PSU__UART0__MODEM__ENABLE 0 \
  CONFIG.PSU__UART0__PERIPHERAL__ENABLE 1 \
  CONFIG.PSU__UART0__PERIPHERAL__IO {MIO 26 .. 27} \
  CONFIG.PSU__UART1__BAUD_RATE 115200 \
  CONFIG.PSU__UART1__MODEM__ENABLE 0 \
  CONFIG.PSU__UART1__PERIPHERAL__ENABLE 1 \
  CONFIG.PSU__UART1__PERIPHERAL__IO EMIO \
  CONFIG.PSU__USB0_COHERENCY 0 \
  CONFIG.PSU__USB0__PERIPHERAL__ENABLE 1 \
  CONFIG.PSU__USB0__PERIPHERAL__IO {MIO 52 .. 63} \
  CONFIG.PSU__USB0__REF_CLK_FREQ 26 \
  CONFIG.PSU__USB0__REF_CLK_SEL {Ref Clk2} \
  CONFIG.PSU__USB2_0__EMIO__ENABLE 0 \
  CONFIG.PSU__USB3_0__EMIO__ENABLE 0 \
  CONFIG.PSU__USB3_0__PERIPHERAL__ENABLE 1 \
  CONFIG.PSU__USB3_0__PERIPHERAL__IO {GT Lane2} \
  CONFIG.PSU__USB__RESET__MODE {Boot Pin} \
  CONFIG.PSU__USB__RESET__POLARITY {Active Low} \
  CONFIG.PSU__USE__IRQ0 1 \
  CONFIG.PSU__USE__IRQ1 1 \
  CONFIG.PSU__USE__M_AXI_GP0 1 \
  CONFIG.PSU__USE__M_AXI_GP1 1 \
  CONFIG.PSU__USE__M_AXI_GP2 1 \
  CONFIG.PSU__USE__S_AXI_GP0 1 \
  CONFIG.PSU__USE__S_AXI_GP1 1 \
  CONFIG.QSPI_BOARD_INTERFACE custom \
  CONFIG.SATA_BOARD_INTERFACE custom \
  CONFIG.SD0_BOARD_INTERFACE custom \
  CONFIG.SD1_BOARD_INTERFACE custom \
  CONFIG.SPI0_BOARD_INTERFACE custom \
  CONFIG.SPI1_BOARD_INTERFACE custom \
  CONFIG.SUBPRESET1 Custom \
  CONFIG.SUBPRESET2 Custom \
  CONFIG.SWDT0_BOARD_INTERFACE custom \
  CONFIG.SWDT1_BOARD_INTERFACE custom \
  CONFIG.TRACE_BOARD_INTERFACE custom \
  CONFIG.TTC0_BOARD_INTERFACE custom \
  CONFIG.TTC1_BOARD_INTERFACE custom \
  CONFIG.TTC2_BOARD_INTERFACE custom \
  CONFIG.TTC3_BOARD_INTERFACE custom \
  CONFIG.UART0_BOARD_INTERFACE custom \
  CONFIG.UART1_BOARD_INTERFACE custom \
  CONFIG.USB0_BOARD_INTERFACE custom \
  CONFIG.USB1_BOARD_INTERFACE custom \
  CONFIG.preset None \
] [get_bd_cells zynq_ultra_ps_e_0]
# 793 more settings of zynq_ultra_ps_e_0 are not shown: defaults, MIO pin electricals, DDR timing, and values the tool derives

# ---- hierarchy /mem ----
current_bd_instance /mem
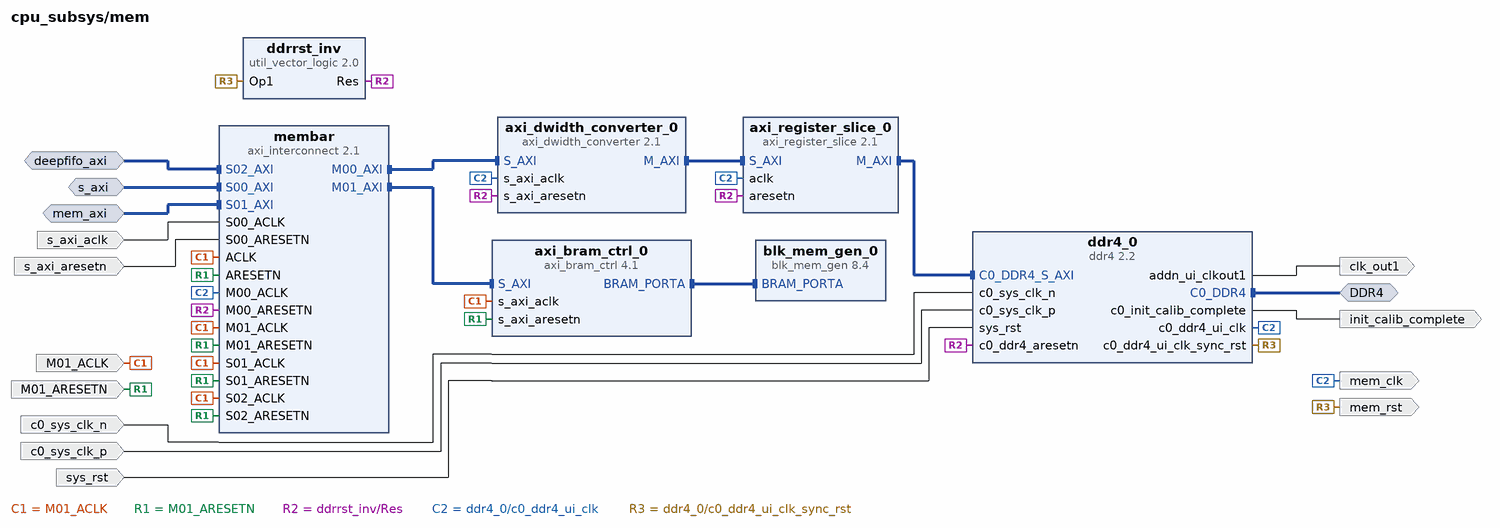
[diagram p1: block diagram inside /mem]
create_bd_intf_pin -mode Master -vlnv xilinx.com:interface:ddr4_rtl:1.0 DDR4
create_bd_intf_pin -mode Slave -vlnv xilinx.com:interface:aximm_rtl:1.0 deepfifo_axi
create_bd_intf_pin -mode Slave -vlnv xilinx.com:interface:aximm_rtl:1.0 mem_axi
create_bd_intf_pin -mode Slave -vlnv xilinx.com:interface:aximm_rtl:1.0 s_axi
create_bd_pin -dir I -type clk M01_ACLK
create_bd_pin -dir I -type rst M01_ARESETN
create_bd_pin -dir I -type clk c0_sys_clk_n
create_bd_pin -dir I -type clk c0_sys_clk_p
create_bd_pin -dir O -type clk clk_out1
create_bd_pin -dir O init_calib_complete
create_bd_pin -dir O -type clk mem_clk
create_bd_pin -dir O -type rst mem_rst
create_bd_pin -dir I -type clk s_axi_aclk
create_bd_pin -dir I -type rst s_axi_aresetn
create_bd_pin -dir I -type rst sys_rst

create_bd_cell -type ip -vlnv xilinx.com:ip:axi_bram_ctrl:4.1 axi_bram_ctrl_0
set_property -dict {CONFIG.DATA_WIDTH 512 CONFIG.SINGLE_PORT_BRAM 1} [get_bd_cells axi_bram_ctrl_0]
create_bd_cell -type ip -vlnv xilinx.com:ip:axi_dwidth_converter:2.1 axi_dwidth_converter_0
set_property -dict {CONFIG.MI_DATA_WIDTH 256 CONFIG.SI_DATA_WIDTH 512} [get_bd_cells axi_dwidth_converter_0]
create_bd_cell -type ip -vlnv xilinx.com:ip:axi_register_slice:2.1 axi_register_slice_0
create_bd_cell -type ip -vlnv xilinx.com:ip:blk_mem_gen:8.4 blk_mem_gen_0
set_property -dict [list \
  CONFIG.Memory_Type Single_Port_RAM \
  CONFIG.PRIM_type_to_Implement URAM \
  CONFIG.Port_A_Write_Rate 50 \
  CONFIG.Port_B_Clock 0 \
  CONFIG.Port_B_Enable_Rate 0 \
  CONFIG.Port_B_Write_Rate 0 \
] [get_bd_cells blk_mem_gen_0]
create_bd_cell -type ip -vlnv xilinx.com:ip:ddr4:2.2 ddr4_0
set_property -dict [list \
  CONFIG.ADDN_UI_CLKOUT1_FREQ_HZ 100 \
  CONFIG.C0.BANK_GROUP_WIDTH 1 \
  CONFIG.C0.DDR4_AxiAddressWidth 31 \
  CONFIG.C0.DDR4_AxiDataWidth 256 \
  CONFIG.C0.DDR4_CasLatency 18 \
  CONFIG.C0.DDR4_CasWriteLatency 16 \
  CONFIG.C0.DDR4_DataWidth 32 \
  CONFIG.C0.DDR4_InputClockPeriod 3332 \
  CONFIG.C0.DDR4_MemoryPart MT40A512M16HA-075E \
  CONFIG.C0.DDR4_MemoryType Components \
  CONFIG.C0.DDR4_TimePeriod 833 \
  CONFIG.System_Clock Differential \
] [get_bd_cells ddr4_0]
create_bd_cell -type ip -vlnv xilinx.com:ip:util_vector_logic:2.0 ddrrst_inv
set_property -dict {CONFIG.C_OPERATION not CONFIG.C_SIZE 1} [get_bd_cells ddrrst_inv]
create_bd_cell -type ip -vlnv xilinx.com:ip:axi_interconnect:2.1 membar
set_property -dict [list \
  CONFIG.ENABLE_ADVANCED_OPTIONS 1 \
  CONFIG.M00_HAS_DATA_FIFO 2 \
  CONFIG.M00_HAS_REGSLICE 4 \
  CONFIG.M01_HAS_DATA_FIFO 1 \
  CONFIG.M01_HAS_REGSLICE 4 \
  CONFIG.NUM_MI 2 \
  CONFIG.NUM_SI 3 \
  CONFIG.S00_HAS_DATA_FIFO 2 \
  CONFIG.S00_HAS_REGSLICE 4 \
  CONFIG.S01_HAS_DATA_FIFO 2 \
  CONFIG.S01_HAS_REGSLICE 4 \
  CONFIG.S02_HAS_DATA_FIFO 2 \
  CONFIG.S02_HAS_REGSLICE 4 \
  CONFIG.STRATEGY 2 \
  CONFIG.SYNCHRONIZATION_STAGES 8 \
  CONFIG.XBAR_DATA_WIDTH 512 \
] [get_bd_cells membar]

# ---- connections ----

current_bd_instance /mem
connect_bd_intf_net [get_bd_intf_pins deepfifo_axi] [get_bd_intf_pins membar/S02_AXI]
connect_bd_intf_net [get_bd_intf_pins axi_dwidth_converter_0/M_AXI] [get_bd_intf_pins axi_register_slice_0/S_AXI]
connect_bd_intf_net [get_bd_intf_pins axi_bram_ctrl_0/S_AXI] [get_bd_intf_pins membar/M01_AXI]
connect_bd_intf_net [get_bd_intf_pins DDR4] [get_bd_intf_pins ddr4_0/C0_DDR4]
connect_bd_intf_net [get_bd_intf_pins axi_dwidth_converter_0/S_AXI] [get_bd_intf_pins membar/M00_AXI]
connect_bd_intf_net [get_bd_intf_pins axi_register_slice_0/M_AXI] [get_bd_intf_pins ddr4_0/C0_DDR4_S_AXI]
connect_bd_intf_net [get_bd_intf_pins axi_bram_ctrl_0/BRAM_PORTA] [get_bd_intf_pins blk_mem_gen_0/BRAM_PORTA]
connect_bd_intf_net -intf_net S00_AXI_0_1 [get_bd_intf_pins s_axi] [get_bd_intf_pins membar/S00_AXI]
connect_bd_intf_net [get_bd_intf_pins mem_axi] [get_bd_intf_pins membar/S01_AXI]
connect_bd_net [get_bd_pins M01_ACLK] \
  [get_bd_pins axi_bram_ctrl_0/s_axi_aclk] [get_bd_pins membar/ACLK] [get_bd_pins membar/M01_ACLK] \
  [get_bd_pins membar/S01_ACLK] [get_bd_pins membar/S02_ACLK]
connect_bd_net [get_bd_pins M01_ARESETN] \
  [get_bd_pins axi_bram_ctrl_0/s_axi_aresetn] [get_bd_pins membar/ARESETN] [get_bd_pins membar/M01_ARESETN] \
  [get_bd_pins membar/S01_ARESETN] [get_bd_pins membar/S02_ARESETN]
connect_bd_net -net S00_ACLK_1 [get_bd_pins s_axi_aclk] [get_bd_pins membar/S00_ACLK]
connect_bd_net [get_bd_pins c0_sys_clk_n] [get_bd_pins ddr4_0/c0_sys_clk_n]
connect_bd_net [get_bd_pins c0_sys_clk_p] [get_bd_pins ddr4_0/c0_sys_clk_p]
connect_bd_net -net clk_inv_Res [get_bd_pins ddrrst_inv/Res] \
  [get_bd_pins axi_dwidth_converter_0/s_axi_aresetn] [get_bd_pins axi_register_slice_0/aresetn] \
  [get_bd_pins ddr4_0/c0_ddr4_aresetn] [get_bd_pins membar/M00_ARESETN]
connect_bd_net [get_bd_pins ddr4_0/addn_ui_clkout1] [get_bd_pins clk_out1]
connect_bd_net [get_bd_pins ddr4_0/c0_ddr4_ui_clk] \
  [get_bd_pins mem_clk] [get_bd_pins axi_dwidth_converter_0/s_axi_aclk] [get_bd_pins axi_register_slice_0/aclk] \
  [get_bd_pins membar/M00_ACLK]
connect_bd_net [get_bd_pins ddr4_0/c0_ddr4_ui_clk_sync_rst] [get_bd_pins mem_rst] [get_bd_pins ddrrst_inv/Op1]
connect_bd_net [get_bd_pins ddr4_0/c0_init_calib_complete] [get_bd_pins init_calib_complete]
connect_bd_net [get_bd_pins s_axi_aresetn] [get_bd_pins membar/S00_ARESETN]
connect_bd_net [get_bd_pins sys_rst] [get_bd_pins ddr4_0/sys_rst]

current_bd_instance /
connect_bd_intf_net [get_bd_intf_pins axi_bram/S_AXI] [get_bd_intf_pins hpm_inter/M03_AXI]
connect_bd_intf_net [get_bd_intf_ports vout12] [get_bd_intf_pins rfdc4x4/vout12]
connect_bd_intf_net -intf_net s10_axis_0_1 [get_bd_intf_ports s10_axis] [get_bd_intf_pins rfdc4x4/s10_axis]
connect_bd_intf_net [get_bd_intf_ports m10_axis] [get_bd_intf_pins rfdc4x4/m10_axis]
connect_bd_intf_net [get_bd_intf_pins axi_uart16550_0/S_AXI] [get_bd_intf_pins hpm_inter/M07_AXI]
connect_bd_intf_net [get_bd_intf_ports m01_axis] [get_bd_intf_pins rfdc4x4/m01_axis]
connect_bd_intf_net [get_bd_intf_ports m02_axis] [get_bd_intf_pins rfdc4x4/m02_axis]
connect_bd_intf_net [get_bd_intf_ports m12_axis] [get_bd_intf_pins rfdc4x4/m12_axis]
connect_bd_intf_net [get_bd_intf_ports vout02] [get_bd_intf_pins rfdc4x4/vout02]
connect_bd_intf_net [get_bd_intf_ports m13_axis] [get_bd_intf_pins rfdc4x4/m13_axis]
connect_bd_intf_net [get_bd_intf_ports m11_axis] [get_bd_intf_pins rfdc4x4/m11_axis]
connect_bd_intf_net [get_bd_intf_ports vout00] [get_bd_intf_pins rfdc4x4/vout00]
connect_bd_intf_net [get_bd_intf_pins axi_uart16550_1/S_AXI] [get_bd_intf_pins hpm_inter/M08_AXI]
connect_bd_intf_net [get_bd_intf_ports DDR4] [get_bd_intf_pins mem/DDR4]
connect_bd_intf_net -intf_net dac0_clk_0_1 [get_bd_intf_ports dac0_clk] [get_bd_intf_pins rfdc4x4/dac0_clk]
connect_bd_intf_net -intf_net axi_interconnect_0_M01_AXI [get_bd_intf_pins axi_dma_0/S_AXI_LITE] [get_bd_intf_pins hpm_inter/M01_AXI]
connect_bd_intf_net [get_bd_intf_ports m00_axis] [get_bd_intf_pins rfdc4x4/m00_axis]
connect_bd_intf_net [get_bd_intf_pins axi_dma_0/M_AXI] [get_bd_intf_pins smartconnect_0/S01_AXI]
connect_bd_intf_net [get_bd_intf_ports m03_axis] [get_bd_intf_pins rfdc4x4/m03_axis]
connect_bd_intf_net [get_bd_intf_ports vout10] [get_bd_intf_pins rfdc4x4/vout10]
connect_bd_intf_net -intf_net axi_bram_ctrl_0_BRAM_PORTA [get_bd_intf_pins blkmem0/BRAM_PORTA] [get_bd_intf_pins bram0/BRAM_PORTA]
connect_bd_intf_net [get_bd_intf_pins hpm_inter/M06_AXI] [get_bd_intf_pins sysmon/S_AXI_LITE]
connect_bd_intf_net -intf_net s00_axis_0_1 [get_bd_intf_ports s00_axis] [get_bd_intf_pins rfdc4x4/s00_axis]
connect_bd_intf_net -intf_net s02_axis_0_1 [get_bd_intf_ports s02_axis] [get_bd_intf_pins rfdc4x4/s02_axis]
connect_bd_intf_net [get_bd_intf_ports app_lite] [get_bd_intf_pins hpm_inter/M04_AXI]
connect_bd_intf_net [get_bd_intf_pins axi_dma_0/M_AXI_SG] [get_bd_intf_pins smartconnect_0/S00_AXI]
connect_bd_intf_net -intf_net adc1_clk_0_1 [get_bd_intf_ports adc1_clk] [get_bd_intf_pins rfdc4x4/adc1_clk]
connect_bd_intf_net [get_bd_intf_ports SPI0] [get_bd_intf_pins zynq_ultra_ps_e_0/SPI_0]
connect_bd_intf_net [get_bd_intf_pins axilite_dma/S00_AXI] [get_bd_intf_pins hpm_inter/M02_AXI]
connect_bd_intf_net -intf_net adc0_dsa_rts_0_1 [get_bd_intf_ports adc0_dsa_rts] [get_bd_intf_pins rfdc4x4/adc0_dsa_rts]
connect_bd_intf_net -intf_net adc1_dsa_rts_0_1 [get_bd_intf_ports adc1_dsa_rts] [get_bd_intf_pins rfdc4x4/adc1_dsa_rts]
connect_bd_intf_net -intf_net vin0_23_0_1 [get_bd_intf_ports vin0_23] [get_bd_intf_pins rfdc4x4/vin0_23]
connect_bd_intf_net -intf_net axi_interconnect_0_M00_AXI [get_bd_intf_pins bram0/S_AXI] [get_bd_intf_pins hpm_inter/M00_AXI]
connect_bd_intf_net -intf_net sysref_in_0_1 [get_bd_intf_ports sysref_in] [get_bd_intf_pins rfdc4x4/sysref_in]
connect_bd_intf_net [get_bd_intf_pins hpm_inter/M05_AXI] [get_bd_intf_pins rfdc4x4/s_axi]
connect_bd_intf_net -intf_net vin1_23_0_1 [get_bd_intf_ports vin1_23] [get_bd_intf_pins rfdc4x4/vin1_23]
connect_bd_intf_net [get_bd_intf_pins fpm0inter/M02_AXI] [get_bd_intf_pins mem/s_axi]
connect_bd_intf_net -intf_net S02_AXI_0_1 [get_bd_intf_ports deepfifo_axi] [get_bd_intf_pins mem/deepfifo_axi]
connect_bd_intf_net [get_bd_intf_ports PLUART] [get_bd_intf_pins zynq_ultra_ps_e_0/UART_1]
connect_bd_intf_net -intf_net S_AXI_HPC1_FPD_0_1 [get_bd_intf_ports S_AXI_HPC1] [get_bd_intf_pins zynq_ultra_ps_e_0/S_AXI_HPC1_FPD]
connect_bd_intf_net [get_bd_intf_pins fpm0inter/S00_AXI] [get_bd_intf_pins zynq_ultra_ps_e_0/M_AXI_HPM0_FPD]
connect_bd_intf_net [get_bd_intf_pins hpm_inter/S00_AXI] [get_bd_intf_pins zynq_ultra_ps_e_0/M_AXI_HPM0_LPD]
connect_bd_intf_net -intf_net adc1_rts_0_1 [get_bd_intf_ports adc1_rts] [get_bd_intf_pins rfdc4x4/adc1_rts]
connect_bd_intf_net -intf_net adc0_rts_0_1 [get_bd_intf_ports adc0_rts] [get_bd_intf_pins rfdc4x4/adc0_rts]
connect_bd_intf_net -intf_net vin1_01_0_1 [get_bd_intf_ports vin1_01] [get_bd_intf_pins rfdc4x4/vin1_01]
connect_bd_intf_net -intf_net S_AXIS_S2MM_0_1 [get_bd_intf_ports S_DMA_AXIS] [get_bd_intf_pins axi_dma_0/S_AXIS_S2MM]
connect_bd_intf_net -intf_net BRAM_PORTB_0_1 [get_bd_intf_ports AUXRAM] [get_bd_intf_pins blkmem0/BRAM_PORTB]
connect_bd_intf_net [get_bd_intf_pins smartconnect_0/M00_AXI] [get_bd_intf_pins zynq_ultra_ps_e_0/S_AXI_HPC0_FPD]
connect_bd_intf_net [get_bd_intf_ports adc0_clk] [get_bd_intf_pins rfdc4x4/adc0_clk]
connect_bd_intf_net [get_bd_intf_ports M_DMA_AXIS] [get_bd_intf_pins axi_dma_0/M_AXIS_MM2S]
connect_bd_intf_net -intf_net S01_AXI_0_1 [get_bd_intf_ports mem_axi] [get_bd_intf_pins mem/mem_axi]
connect_bd_intf_net -intf_net vin0_01_0_1 [get_bd_intf_ports vin0_01] [get_bd_intf_pins rfdc4x4/vin0_01]
connect_bd_intf_net -intf_net s12_axis_0_1 [get_bd_intf_ports s12_axis] [get_bd_intf_pins rfdc4x4/s12_axis]
connect_bd_net -net ARESETN_1 [get_bd_pins proc_sys_reset_0/peripheral_aresetn] \
  [get_bd_ports pl_resetn0] [get_bd_pins axi_bram/s_axi_aresetn] [get_bd_pins axi_uart16550_0/s_axi_aresetn] \
  [get_bd_pins axi_uart16550_1/s_axi_aresetn] [get_bd_pins axilite_dma/s00_axi_aresetn] [get_bd_pins bram0/s_axi_aresetn] \
  [get_bd_pins fpm0inter/M02_ARESETN] [get_bd_pins fpm0inter/S00_ARESETN] [get_bd_pins hpm_inter/ARESETN] \
  [get_bd_pins hpm_inter/M00_ARESETN] [get_bd_pins hpm_inter/M02_ARESETN] [get_bd_pins hpm_inter/M03_ARESETN] \
  [get_bd_pins hpm_inter/M04_ARESETN] [get_bd_pins hpm_inter/M05_ARESETN] [get_bd_pins hpm_inter/M06_ARESETN] \
  [get_bd_pins hpm_inter/M07_ARESETN] [get_bd_pins hpm_inter/M08_ARESETN] [get_bd_pins hpm_inter/S00_ARESETN] \
  [get_bd_pins mem/s_axi_aresetn] [get_bd_pins rfdc4x4/s_axi_aresetn] [get_bd_pins smartconnect_0/aresetn] \
  [get_bd_pins sysmon/s_axi_aresetn] [get_bd_pins fpm0inter/M01_ARESETN] [get_bd_pins fpm0inter/M00_ARESETN] \
  [get_bd_pins fpm0inter/ARESETN]
connect_bd_net -net acprot_1 [get_bd_ports axprot] \
  [get_bd_pins zynq_ultra_ps_e_0/saxigp0_arprot] [get_bd_pins zynq_ultra_ps_e_0/saxigp0_awprot] \
  [get_bd_pins zynq_ultra_ps_e_0/saxigp1_arprot] [get_bd_pins zynq_ultra_ps_e_0/saxigp1_awprot]
connect_bd_net [get_bd_ports adc_clk] \
  [get_bd_pins rfdc4x4/m0_axis_aclk] [get_bd_pins rfdc4x4/m1_axis_aclk] [get_bd_pins rfdc4x4/m2_axis_aclk] \
  [get_bd_pins rfdc4x4/m3_axis_aclk]
connect_bd_net [get_bd_ports adc_rstn] \
  [get_bd_pins rfdc4x4/m0_axis_aresetn] [get_bd_pins rfdc4x4/m1_axis_aresetn] [get_bd_pins rfdc4x4/m2_axis_aresetn] \
  [get_bd_pins rfdc4x4/m3_axis_aresetn]
connect_bd_net -net app_status0_0_1 [get_bd_ports app_status0] [get_bd_pins axilite_dma/app_status0]
connect_bd_net -net app_status1_0_1 [get_bd_ports app_status1] [get_bd_pins axilite_dma/app_status1]
connect_bd_net -net app_status2_0_1 [get_bd_ports app_status2] [get_bd_pins axilite_dma/app_status2]
connect_bd_net -net app_status3_0_1 [get_bd_ports app_status3] [get_bd_pins axilite_dma/app_status3]
connect_bd_net -net app_status4_0_1 [get_bd_ports app_status4] [get_bd_pins axilite_dma/app_status4]
connect_bd_net -net app_status5_0_1 [get_bd_ports app_status5] [get_bd_pins axilite_dma/app_status5]
connect_bd_net -net app_status6_0_1 [get_bd_ports app_status6] [get_bd_pins axilite_dma/app_status6]
connect_bd_net -net app_status7_0_1 [get_bd_ports app_status7] [get_bd_pins axilite_dma/app_status7]
connect_bd_net [get_bd_ports axcache] \
  [get_bd_pins zynq_ultra_ps_e_0/saxigp0_arcache] [get_bd_pins zynq_ultra_ps_e_0/saxigp0_awcache] \
  [get_bd_pins zynq_ultra_ps_e_0/saxigp1_arcache] [get_bd_pins zynq_ultra_ps_e_0/saxigp1_awcache]
connect_bd_net -net axi_bram_ctrl_0_bram_addr_a [get_bd_pins axi_bram/bram_addr_a] [get_bd_ports bram_addr]
connect_bd_net -net axi_bram_ctrl_0_bram_clk_a [get_bd_pins axi_bram/bram_clk_a] [get_bd_ports bram_clk]
connect_bd_net -net axi_bram_ctrl_0_bram_en_a [get_bd_pins axi_bram/bram_en_a] [get_bd_ports bram_en]
connect_bd_net -net axi_bram_ctrl_0_bram_rst_a [get_bd_pins axi_bram/bram_rst_a] [get_bd_ports bram_rst]
connect_bd_net -net axi_bram_ctrl_0_bram_we_a [get_bd_pins axi_bram/bram_we_a] [get_bd_ports bram_we]
connect_bd_net -net axi_bram_ctrl_0_bram_wrdata_a [get_bd_pins axi_bram/bram_wrdata_a] [get_bd_ports bram_wrdata]
connect_bd_net [get_bd_pins axi_dma_0/mm2s_introut] [get_bd_pins xlconcat_0/In6]
connect_bd_net [get_bd_pins axi_dma_0/mm2s_prmry_reset_out_n] [get_bd_ports mm2s_resetn_out]
connect_bd_net [get_bd_pins axi_dma_0/s2mm_introut] [get_bd_pins xlconcat_0/In7]
connect_bd_net [get_bd_pins axi_dma_0/s2mm_prmry_reset_out_n] [get_bd_ports s2mm_resetn_out]
connect_bd_net [get_bd_pins axi_uart16550_0/ip2intc_irpt] [get_bd_pins xlconcat_1/In0]
connect_bd_net [get_bd_pins axi_uart16550_0/sout] [get_bd_ports useruart0_tx]
connect_bd_net [get_bd_pins axi_uart16550_1/ip2intc_irpt] [get_bd_pins xlconcat_1/In1]
connect_bd_net [get_bd_pins axi_uart16550_1/sout] [get_bd_ports useruart1_tx]
connect_bd_net -net axilite_slave_0_app_param0 [get_bd_pins axilite_dma/app_param0] [get_bd_ports app_param0]
connect_bd_net -net axilite_slave_0_app_param1 [get_bd_pins axilite_dma/app_param1] [get_bd_ports app_param1]
connect_bd_net -net axilite_slave_0_app_param2 [get_bd_pins axilite_dma/app_param2] [get_bd_ports app_param2]
connect_bd_net -net axilite_slave_0_app_param3 [get_bd_pins axilite_dma/app_param3] [get_bd_ports app_param3]
connect_bd_net -net axilite_slave_0_app_param4 [get_bd_pins axilite_dma/app_param4] [get_bd_ports app_param4]
connect_bd_net -net axilite_slave_0_app_param5 [get_bd_pins axilite_dma/app_param5] [get_bd_ports app_param5]
connect_bd_net -net axilite_slave_0_app_param6 [get_bd_pins axilite_dma/app_param6] [get_bd_ports app_param6]
connect_bd_net -net axilite_slave_0_app_param7 [get_bd_pins axilite_dma/app_param7] [get_bd_ports app_param7]
connect_bd_net -net bram_rddata_a_0_1 [get_bd_ports bram_rddata] [get_bd_pins axi_bram/bram_rddata_a]
connect_bd_net -net c0_sys_clk_n_0_1 [get_bd_ports c0_sys_clk_n] [get_bd_pins mem/c0_sys_clk_n]
connect_bd_net -net c0_sys_clk_p_0_1 [get_bd_ports c0_sys_clk_p] [get_bd_pins mem/c0_sys_clk_p]
connect_bd_net [get_bd_ports dac_clk] [get_bd_pins rfdc4x4/s0_axis_aclk] [get_bd_pins rfdc4x4/s1_axis_aclk]
connect_bd_net [get_bd_ports dac_rstn] [get_bd_pins rfdc4x4/s0_axis_aresetn] [get_bd_pins rfdc4x4/s1_axis_aresetn]
connect_bd_net [get_bd_pins mem/clk_out1] [get_bd_ports clk_out100]
connect_bd_net [get_bd_pins mem/init_calib_complete] [get_bd_ports init_calib_complete]
connect_bd_net [get_bd_pins proc_sys_reset_data/peripheral_aresetn] \
  [get_bd_ports pl_resetn1] [get_bd_pins axi_dma_0/axi_resetn] [get_bd_pins hpm_inter/M01_ARESETN] \
  [get_bd_pins mem/M01_ARESETN]
connect_bd_net [get_bd_pins rfdc4x4/clk_adc0] [get_bd_ports clk_adc0]
connect_bd_net [get_bd_pins rfdc4x4/clk_adc1] [get_bd_ports clk_adc1]
connect_bd_net [get_bd_pins rfdc4x4/clk_dac0] [get_bd_ports clk_dac0]
connect_bd_net [get_bd_pins rfdc4x4/clk_dac1] [get_bd_ports clk_dac1]
connect_bd_net -net sin_0_1 [get_bd_ports useruart0_rx] [get_bd_pins axi_uart16550_0/sin]
connect_bd_net -net sin_1_1 [get_bd_ports useruart1_rx] [get_bd_pins axi_uart16550_1/sin]
connect_bd_net -net sys_rst_0_1 [get_bd_ports ddr_rst] [get_bd_pins mem/sys_rst]
connect_bd_net [get_bd_ports user_sysref_adc] [get_bd_pins rfdc4x4/user_sysref_adc]
connect_bd_net [get_bd_ports user_sysref_dac] [get_bd_pins rfdc4x4/user_sysref_dac]
connect_bd_net [get_bd_pins xlconcat_0/dout] [get_bd_pins zynq_ultra_ps_e_0/pl_ps_irq0]
connect_bd_net [get_bd_pins xlconcat_1/dout] [get_bd_pins zynq_ultra_ps_e_0/pl_ps_irq1]
connect_bd_net [get_bd_pins xlconstant_0/dout] [get_bd_pins axi_uart16550_0/freeze] [get_bd_pins axi_uart16550_1/freeze]
